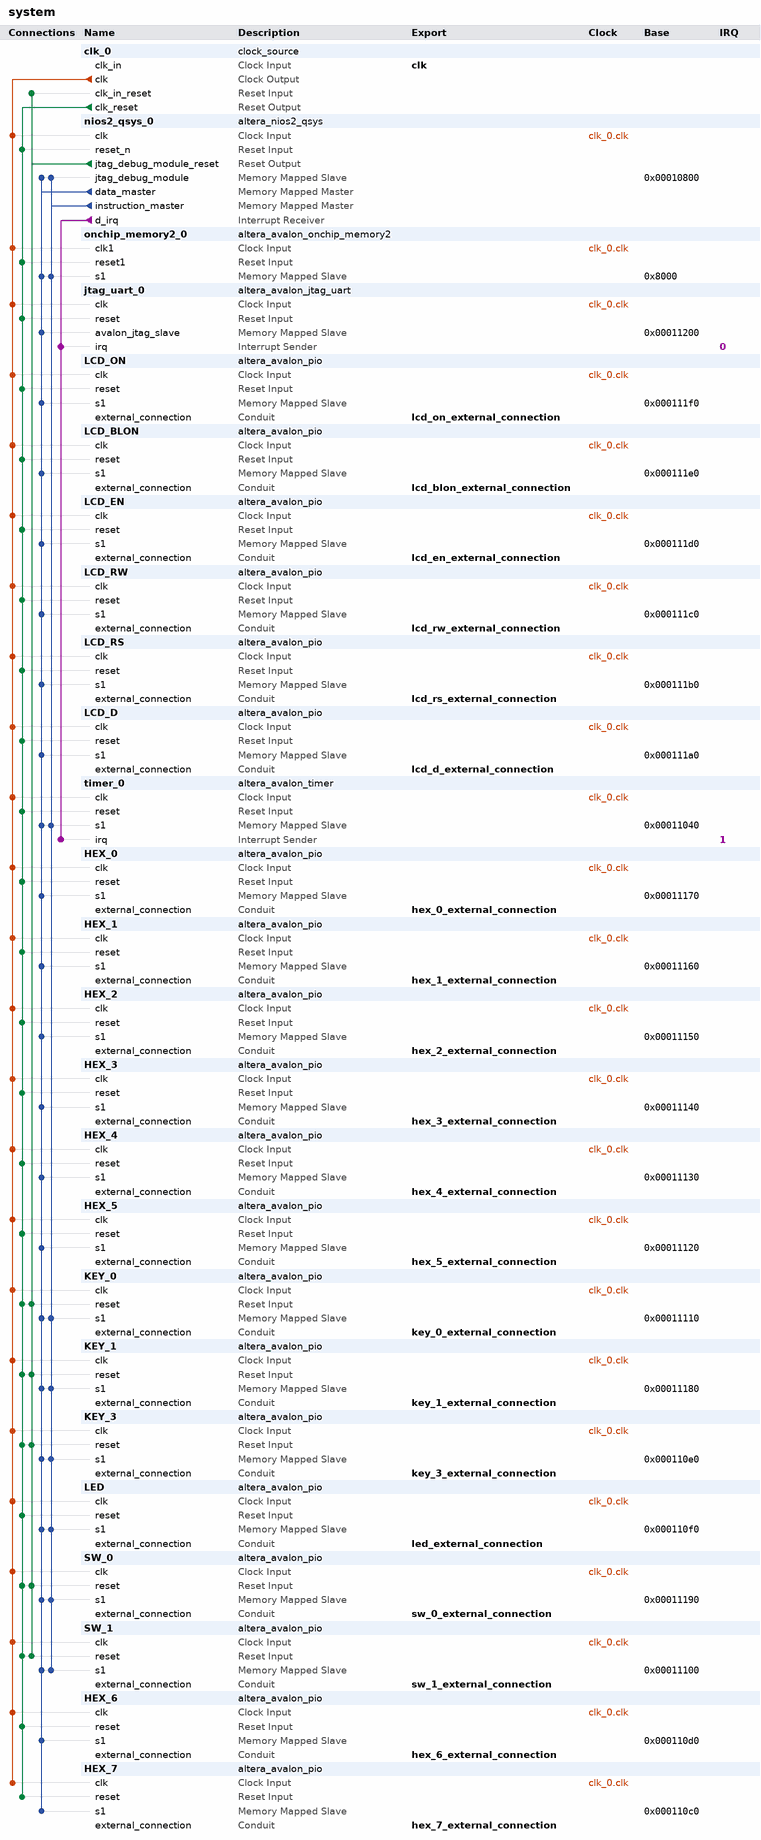
[diagram p0: system contents]
# Platform Designer (Qsys) system system, Cyclone IV E EP4CE115F29C8
# Parameters at their usual value, and those the tool derives, are not listed.
package require -exact qsys 13.0.1.99.2
create_system system
set_project_property DEVICE_FAMILY {Cyclone IV E}
set_project_property DEVICE EP4CE115F29C8

add_instance clk_0 clock_source 13.0
set_instance_parameter_value clk_0 clockFrequency 50000000

add_instance nios2_qsys_0 altera_nios2_qsys 13.0
set_instance_parameter_value nios2_qsys_0 resetSlave onchip_memory2_0.s1
set_instance_parameter_value nios2_qsys_0 mmu_TLBMissExcSlave None
set_instance_parameter_value nios2_qsys_0 exceptionSlave onchip_memory2_0.s1
set_instance_parameter_value nios2_qsys_0 breakSlave nios2_qsys_0.jtag_debug_module
set_instance_parameter_value nios2_qsys_0 impl Tiny
set_instance_parameter_value nios2_qsys_0 icache_size 4096

add_instance onchip_memory2_0 altera_avalon_onchip_memory2 13.0.1.99.2
set_instance_parameter_value onchip_memory2_0 dataWidth 32
set_instance_parameter_value onchip_memory2_0 dualPort false
set_instance_parameter_value onchip_memory2_0 initMemContent true
set_instance_parameter_value onchip_memory2_0 initializationFileName onchip_mem.hex
set_instance_parameter_value onchip_memory2_0 memorySize 32768

add_instance jtag_uart_0 altera_avalon_jtag_uart 13.0.1.99.2
set_instance_parameter_value jtag_uart_0 simInteractiveOptions NO_INTERACTIVE_WINDOWS

add_instance LCD_ON altera_avalon_pio 13.0.1.99.2
set_instance_parameter_value LCD_ON direction Output
set_instance_parameter_value LCD_ON width 1

add_instance LCD_BLON altera_avalon_pio 13.0.1.99.2
set_instance_parameter_value LCD_BLON direction Output
set_instance_parameter_value LCD_BLON width 1

add_instance LCD_EN altera_avalon_pio 13.0.1.99.2
set_instance_parameter_value LCD_EN direction Output
set_instance_parameter_value LCD_EN width 1

add_instance LCD_RW altera_avalon_pio 13.0.1.99.2
set_instance_parameter_value LCD_RW direction Output
set_instance_parameter_value LCD_RW width 1

add_instance LCD_RS altera_avalon_pio 13.0.1.99.2
set_instance_parameter_value LCD_RS direction Output
set_instance_parameter_value LCD_RS width 1

add_instance LCD_D altera_avalon_pio 13.0.1.99.2
set_instance_parameter_value LCD_D direction Output
set_instance_parameter_value LCD_D width 8

add_instance timer_0 altera_avalon_timer 13.0.1.99.2
set_instance_parameter_value timer_0 period 4
set_instance_parameter_value timer_0 periodUnits SEC

add_instance HEX_0 altera_avalon_pio 13.0.1.99.2
set_instance_parameter_value HEX_0 direction Output
set_instance_parameter_value HEX_0 width 8

add_instance HEX_1 altera_avalon_pio 13.0.1.99.2
set_instance_parameter_value HEX_1 direction Output
set_instance_parameter_value HEX_1 width 8

add_instance HEX_2 altera_avalon_pio 13.0.1.99.2
set_instance_parameter_value HEX_2 direction Output
set_instance_parameter_value HEX_2 width 8

add_instance HEX_3 altera_avalon_pio 13.0.1.99.2
set_instance_parameter_value HEX_3 direction Output
set_instance_parameter_value HEX_3 width 8

add_instance HEX_4 altera_avalon_pio 13.0.1.99.2
set_instance_parameter_value HEX_4 direction Output
set_instance_parameter_value HEX_4 width 8

add_instance HEX_5 altera_avalon_pio 13.0.1.99.2
set_instance_parameter_value HEX_5 direction Output
set_instance_parameter_value HEX_5 width 8

add_instance KEY_0 altera_avalon_pio 13.0.1.99.2
set_instance_parameter_value KEY_0 direction Input
set_instance_parameter_value KEY_0 width 1

add_instance KEY_1 altera_avalon_pio 13.0.1.99.2
set_instance_parameter_value KEY_1 direction Input
set_instance_parameter_value KEY_1 width 1

add_instance KEY_3 altera_avalon_pio 13.0.1.99.2
set_instance_parameter_value KEY_3 direction Input
set_instance_parameter_value KEY_3 width 2

add_instance LED altera_avalon_pio 13.0.1.99.2
set_instance_parameter_value LED direction Output
set_instance_parameter_value LED width 8

add_instance SW_0 altera_avalon_pio 13.0.1.99.2
set_instance_parameter_value SW_0 direction Input
set_instance_parameter_value SW_0 width 2

add_instance SW_1 altera_avalon_pio 13.0.1.99.2
set_instance_parameter_value SW_1 direction Input
set_instance_parameter_value SW_1 width 2

add_instance HEX_6 altera_avalon_pio 13.0.1.99.2
set_instance_parameter_value HEX_6 direction Output
set_instance_parameter_value HEX_6 width 8

add_instance HEX_7 altera_avalon_pio 13.0.1.99.2
set_instance_parameter_value HEX_7 direction Output
set_instance_parameter_value HEX_7 width 8

# connections
add_connection clk_0.clk HEX_0.clk clock
add_connection clk_0.clk HEX_1.clk clock
add_connection clk_0.clk HEX_2.clk clock
add_connection clk_0.clk HEX_3.clk clock
add_connection clk_0.clk HEX_4.clk clock
add_connection clk_0.clk HEX_5.clk clock
add_connection clk_0.clk HEX_6.clk clock
add_connection clk_0.clk HEX_7.clk clock
add_connection clk_0.clk jtag_uart_0.clk clock
add_connection clk_0.clk KEY_0.clk clock
add_connection clk_0.clk KEY_1.clk clock
add_connection clk_0.clk KEY_3.clk clock
add_connection clk_0.clk LCD_BLON.clk clock
add_connection clk_0.clk LCD_D.clk clock
add_connection clk_0.clk LCD_EN.clk clock
add_connection clk_0.clk LCD_ON.clk clock
add_connection clk_0.clk LCD_RS.clk clock
add_connection clk_0.clk LCD_RW.clk clock
add_connection clk_0.clk LED.clk clock
add_connection clk_0.clk nios2_qsys_0.clk clock
add_connection clk_0.clk onchip_memory2_0.clk1 clock
add_connection clk_0.clk SW_0.clk clock
add_connection clk_0.clk SW_1.clk clock
add_connection clk_0.clk timer_0.clk clock
add_connection clk_0.clk_reset HEX_0.reset reset
add_connection clk_0.clk_reset HEX_1.reset reset
add_connection clk_0.clk_reset HEX_2.reset reset
add_connection clk_0.clk_reset HEX_3.reset reset
add_connection clk_0.clk_reset HEX_4.reset reset
add_connection clk_0.clk_reset HEX_5.reset reset
add_connection clk_0.clk_reset HEX_6.reset reset
add_connection clk_0.clk_reset HEX_7.reset reset
add_connection clk_0.clk_reset jtag_uart_0.reset reset
add_connection clk_0.clk_reset KEY_0.reset reset
add_connection clk_0.clk_reset KEY_1.reset reset
add_connection clk_0.clk_reset KEY_3.reset reset
add_connection clk_0.clk_reset LCD_BLON.reset reset
add_connection clk_0.clk_reset LCD_D.reset reset
add_connection clk_0.clk_reset LCD_EN.reset reset
add_connection clk_0.clk_reset LCD_ON.reset reset
add_connection clk_0.clk_reset LCD_RS.reset reset
add_connection clk_0.clk_reset LCD_RW.reset reset
add_connection clk_0.clk_reset LED.reset reset
add_connection clk_0.clk_reset nios2_qsys_0.reset_n reset
add_connection clk_0.clk_reset onchip_memory2_0.reset1 reset
add_connection clk_0.clk_reset SW_0.reset reset
add_connection clk_0.clk_reset SW_1.reset reset
add_connection clk_0.clk_reset timer_0.reset reset
add_connection nios2_qsys_0.jtag_debug_module_reset clk_0.clk_in_reset reset
add_connection nios2_qsys_0.jtag_debug_module_reset KEY_0.reset reset
add_connection nios2_qsys_0.jtag_debug_module_reset KEY_1.reset reset
add_connection nios2_qsys_0.jtag_debug_module_reset KEY_3.reset reset
add_connection nios2_qsys_0.jtag_debug_module_reset SW_0.reset reset
add_connection nios2_qsys_0.jtag_debug_module_reset SW_1.reset reset
add_connection nios2_qsys_0.data_master HEX_0.s1 avalon
set_connection_parameter_value nios2_qsys_0.data_master/HEX_0.s1 baseAddress 0x00011170
add_connection nios2_qsys_0.data_master HEX_1.s1 avalon
set_connection_parameter_value nios2_qsys_0.data_master/HEX_1.s1 baseAddress 0x00011160
add_connection nios2_qsys_0.data_master HEX_2.s1 avalon
set_connection_parameter_value nios2_qsys_0.data_master/HEX_2.s1 baseAddress 0x00011150
add_connection nios2_qsys_0.data_master HEX_3.s1 avalon
set_connection_parameter_value nios2_qsys_0.data_master/HEX_3.s1 baseAddress 0x00011140
add_connection nios2_qsys_0.data_master HEX_4.s1 avalon
set_connection_parameter_value nios2_qsys_0.data_master/HEX_4.s1 baseAddress 0x00011130
add_connection nios2_qsys_0.data_master HEX_5.s1 avalon
set_connection_parameter_value nios2_qsys_0.data_master/HEX_5.s1 baseAddress 0x00011120
add_connection nios2_qsys_0.data_master HEX_6.s1 avalon
set_connection_parameter_value nios2_qsys_0.data_master/HEX_6.s1 baseAddress 0x000110d0
add_connection nios2_qsys_0.data_master HEX_7.s1 avalon
set_connection_parameter_value nios2_qsys_0.data_master/HEX_7.s1 baseAddress 0x000110c0
add_connection nios2_qsys_0.data_master jtag_uart_0.avalon_jtag_slave avalon
set_connection_parameter_value nios2_qsys_0.data_master/jtag_uart_0.avalon_jtag_slave baseAddress 0x00011200
add_connection nios2_qsys_0.data_master KEY_0.s1 avalon
set_connection_parameter_value nios2_qsys_0.data_master/KEY_0.s1 baseAddress 0x00011110
add_connection nios2_qsys_0.data_master KEY_1.s1 avalon
set_connection_parameter_value nios2_qsys_0.data_master/KEY_1.s1 baseAddress 0x00011180
add_connection nios2_qsys_0.data_master KEY_3.s1 avalon
set_connection_parameter_value nios2_qsys_0.data_master/KEY_3.s1 baseAddress 0x000110e0
add_connection nios2_qsys_0.data_master LCD_BLON.s1 avalon
set_connection_parameter_value nios2_qsys_0.data_master/LCD_BLON.s1 baseAddress 0x000111e0
add_connection nios2_qsys_0.data_master LCD_D.s1 avalon
set_connection_parameter_value nios2_qsys_0.data_master/LCD_D.s1 baseAddress 0x000111a0
add_connection nios2_qsys_0.data_master LCD_EN.s1 avalon
set_connection_parameter_value nios2_qsys_0.data_master/LCD_EN.s1 baseAddress 0x000111d0
add_connection nios2_qsys_0.data_master LCD_ON.s1 avalon
set_connection_parameter_value nios2_qsys_0.data_master/LCD_ON.s1 baseAddress 0x000111f0
add_connection nios2_qsys_0.data_master LCD_RS.s1 avalon
set_connection_parameter_value nios2_qsys_0.data_master/LCD_RS.s1 baseAddress 0x000111b0
add_connection nios2_qsys_0.data_master LCD_RW.s1 avalon
set_connection_parameter_value nios2_qsys_0.data_master/LCD_RW.s1 baseAddress 0x000111c0
add_connection nios2_qsys_0.data_master LED.s1 avalon
set_connection_parameter_value nios2_qsys_0.data_master/LED.s1 baseAddress 0x000110f0
add_connection nios2_qsys_0.data_master nios2_qsys_0.jtag_debug_module avalon
set_connection_parameter_value nios2_qsys_0.data_master/nios2_qsys_0.jtag_debug_module baseAddress 0x00010800
add_connection nios2_qsys_0.data_master onchip_memory2_0.s1 avalon
set_connection_parameter_value nios2_qsys_0.data_master/onchip_memory2_0.s1 baseAddress 0x8000
add_connection nios2_qsys_0.data_master SW_0.s1 avalon
set_connection_parameter_value nios2_qsys_0.data_master/SW_0.s1 baseAddress 0x00011190
add_connection nios2_qsys_0.data_master SW_1.s1 avalon
set_connection_parameter_value nios2_qsys_0.data_master/SW_1.s1 baseAddress 0x00011100
add_connection nios2_qsys_0.data_master timer_0.s1 avalon
set_connection_parameter_value nios2_qsys_0.data_master/timer_0.s1 baseAddress 0x00011040
add_connection nios2_qsys_0.instruction_master KEY_0.s1 avalon
set_connection_parameter_value nios2_qsys_0.instruction_master/KEY_0.s1 baseAddress 0x00011110
add_connection nios2_qsys_0.instruction_master KEY_1.s1 avalon
set_connection_parameter_value nios2_qsys_0.instruction_master/KEY_1.s1 baseAddress 0x00011180
add_connection nios2_qsys_0.instruction_master KEY_3.s1 avalon
set_connection_parameter_value nios2_qsys_0.instruction_master/KEY_3.s1 baseAddress 0x000110e0
add_connection nios2_qsys_0.instruction_master LED.s1 avalon
set_connection_parameter_value nios2_qsys_0.instruction_master/LED.s1 baseAddress 0x000110f0
add_connection nios2_qsys_0.instruction_master nios2_qsys_0.jtag_debug_module avalon
set_connection_parameter_value nios2_qsys_0.instruction_master/nios2_qsys_0.jtag_debug_module baseAddress 0x00010800
add_connection nios2_qsys_0.instruction_master onchip_memory2_0.s1 avalon
set_connection_parameter_value nios2_qsys_0.instruction_master/onchip_memory2_0.s1 baseAddress 0x8000
add_connection nios2_qsys_0.instruction_master SW_0.s1 avalon
set_connection_parameter_value nios2_qsys_0.instruction_master/SW_0.s1 baseAddress 0x00011190
add_connection nios2_qsys_0.instruction_master SW_1.s1 avalon
set_connection_parameter_value nios2_qsys_0.instruction_master/SW_1.s1 baseAddress 0x00011100
add_connection nios2_qsys_0.instruction_master timer_0.s1 avalon
set_connection_parameter_value nios2_qsys_0.instruction_master/timer_0.s1 baseAddress 0x00011040
add_connection nios2_qsys_0.d_irq jtag_uart_0.irq interrupt
set_connection_parameter_value nios2_qsys_0.d_irq/jtag_uart_0.irq irqNumber 0
add_connection nios2_qsys_0.d_irq timer_0.irq interrupt
set_connection_parameter_value nios2_qsys_0.d_irq/timer_0.irq irqNumber 1

# exported interfaces
add_interface clk clock sink
set_interface_property clk EXPORT_OF clk_0.clk_in
add_interface lcd_d_external_connection conduit end
set_interface_property lcd_d_external_connection EXPORT_OF LCD_D.external_connection
add_interface lcd_rs_external_connection conduit end
set_interface_property lcd_rs_external_connection EXPORT_OF LCD_RS.external_connection
add_interface lcd_rw_external_connection conduit end
set_interface_property lcd_rw_external_connection EXPORT_OF LCD_RW.external_connection
add_interface lcd_en_external_connection conduit end
set_interface_property lcd_en_external_connection EXPORT_OF LCD_EN.external_connection
add_interface lcd_blon_external_connection conduit end
set_interface_property lcd_blon_external_connection EXPORT_OF LCD_BLON.external_connection
add_interface lcd_on_external_connection conduit end
set_interface_property lcd_on_external_connection EXPORT_OF LCD_ON.external_connection
add_interface key_1_external_connection conduit end
set_interface_property key_1_external_connection EXPORT_OF KEY_1.external_connection
add_interface hex_1_external_connection conduit end
set_interface_property hex_1_external_connection EXPORT_OF HEX_1.external_connection
add_interface hex_2_external_connection conduit end
set_interface_property hex_2_external_connection EXPORT_OF HEX_2.external_connection
add_interface hex_3_external_connection conduit end
set_interface_property hex_3_external_connection EXPORT_OF HEX_3.external_connection
add_interface hex_4_external_connection conduit end
set_interface_property hex_4_external_connection EXPORT_OF HEX_4.external_connection
add_interface hex_5_external_connection conduit end
set_interface_property hex_5_external_connection EXPORT_OF HEX_5.external_connection
add_interface key_0_external_connection conduit end
set_interface_property key_0_external_connection EXPORT_OF KEY_0.external_connection
add_interface led_external_connection conduit end
set_interface_property led_external_connection EXPORT_OF LED.external_connection
add_interface key_3_external_connection conduit end
set_interface_property key_3_external_connection EXPORT_OF KEY_3.external_connection
add_interface sw_0_external_connection conduit end
set_interface_property sw_0_external_connection EXPORT_OF SW_0.external_connection
add_interface sw_1_external_connection conduit end
set_interface_property sw_1_external_connection EXPORT_OF SW_1.external_connection
add_interface hex_0_external_connection conduit end
set_interface_property hex_0_external_connection EXPORT_OF HEX_0.external_connection
add_interface hex_6_external_connection conduit end
set_interface_property hex_6_external_connection EXPORT_OF HEX_6.external_connection
add_interface hex_7_external_connection conduit end
set_interface_property hex_7_external_connection EXPORT_OF HEX_7.external_connection

set_interconnect_requirement {$system} qsys_mm.clockCrossingAdapter HANDSHAKE
set_interconnect_requirement {$system} qsys_mm.maxAdditionalLatency 1

save_system system.qsys
